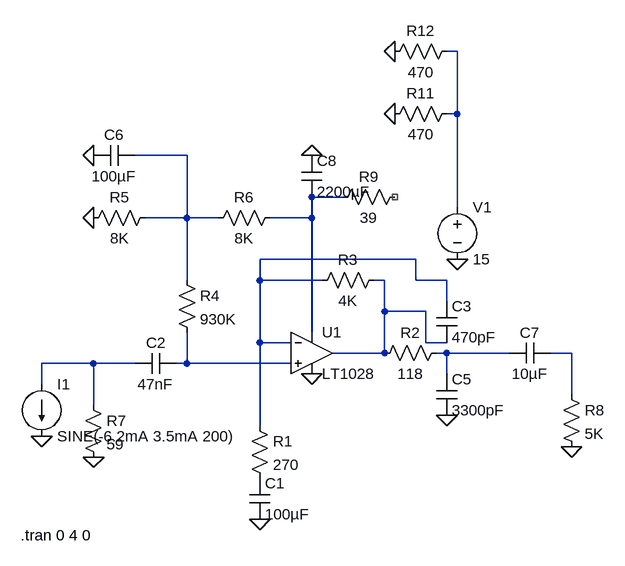
[diagram p0: schematic Draft14.asc]
Draft14.asc, the LTspice schematic file:
Version 4
SHEET 1 880 680
WIRE 400 -272 384 -272
WIRE 400 -176 400 -272
WIRE 400 -176 384 -176
WIRE -16 -112 -96 -112
WIRE 224 -48 176 -48
WIRE 400 -32 400 -176
WIRE -16 -16 -16 -112
WIRE -16 -16 -80 -16
WIRE 32 -16 -16 -16
WIRE 176 -16 176 -48
WIRE 176 -16 112 -16
WIRE 336 48 96 48
WIRE -16 80 -16 -16
WIRE 96 80 96 48
WIRE 192 80 96 80
WIRE 288 80 272 80
WIRE 336 80 336 48
WIRE 384 80 336 80
WIRE 384 112 384 80
WIRE 288 128 288 80
WIRE 352 128 288 128
WIRE 176 160 176 -16
WIRE 96 176 96 80
WIRE 144 176 96 176
WIRE 352 176 352 128
WIRE 384 176 352 176
WIRE 288 192 288 128
WIRE 288 192 208 192
WIRE 384 192 368 192
WIRE 480 192 384 192
WIRE 576 192 544 192
WIRE -160 208 -240 208
WIRE -96 208 -160 208
WIRE -16 208 -16 160
WIRE -16 208 -32 208
WIRE 144 208 -16 208
WIRE 384 224 384 192
WIRE -240 240 -240 208
WIRE 576 256 576 192
WIRE -160 272 -160 208
WIRE 96 304 96 176
FLAG 176 224 0
FLAG 96 448 0
FLAG 400 48 0
FLAG 384 288 0
FLAG -160 -112 0
FLAG -160 -16 0
FLAG -160 352 0
FLAG -240 320 0
FLAG 576 336 0
FLAG 176 -112 0
FLAG 304 -176 0
FLAG 304 -272 0
SYMBOL res 80 288 R0
SYMATTR InstName R1
SYMATTR Value 270
SYMBOL res 272 208 R270
WINDOW 0 32 56 VTop 2
WINDOW 3 0 56 VBottom 2
SYMATTR InstName R2
SYMATTR Value 118
SYMBOL res 176 96 R270
WINDOW 0 32 56 VTop 2
WINDOW 3 0 56 VBottom 2
SYMATTR InstName R3
SYMATTR Value 4K
SYMBOL cap 80 384 R0
SYMATTR InstName C1
SYMATTR Value 100µF
SYMBOL voltage 400 -48 R0
WINDOW 123 0 0 Left 2
WINDOW 39 0 0 Left 2
SYMATTR InstName V1
SYMATTR Value 15
SYMBOL res -32 64 R0
SYMATTR InstName R4
SYMATTR Value 930K
SYMBOL res -64 -32 R90
WINDOW 0 0 56 VBottom 2
WINDOW 3 32 56 VTop 2
SYMATTR InstName R5
SYMATTR Value 8K
SYMBOL res 128 -32 R90
WINDOW 0 0 56 VBottom 2
WINDOW 3 32 56 VTop 2
SYMATTR InstName R6
SYMATTR Value 8K
SYMBOL cap -32 192 R90
WINDOW 0 0 32 VBottom 2
WINDOW 3 32 32 VTop 2
SYMATTR InstName C2
SYMATTR Value 47nF
SYMBOL cap 368 112 R0
SYMATTR InstName C3
SYMATTR Value 470pF
SYMBOL cap 368 224 R0
SYMATTR InstName C5
SYMATTR Value 3300pF
SYMBOL cap -96 -128 R90
WINDOW 0 0 32 VBottom 2
WINDOW 3 32 32 VTop 2
SYMATTR InstName C6
SYMATTR Value 100µF
SYMBOL res -176 256 R0
SYMATTR InstName R7
SYMATTR Value 59
SYMBOL current -240 240 R0
WINDOW 123 0 0 Left 2
WINDOW 39 0 0 Left 2
SYMATTR InstName I1
SYMATTR Value SINE(-6.2mA 3.5mA 200)
SYMBOL cap 544 176 R90
WINDOW 0 0 32 VBottom 2
WINDOW 3 32 32 VTop 2
SYMATTR InstName C7
SYMATTR Value 10µF
SYMBOL res 560 240 R0
SYMATTR InstName R8
SYMATTR Value 5K
SYMBOL res 320 -64 R90
WINDOW 0 0 56 VBottom 2
WINDOW 3 32 56 VTop 2
SYMATTR InstName R9
SYMATTR Value 39
SYMBOL cap 160 -112 R0
SYMATTR InstName C8
SYMATTR Value 2200µF
SYMBOL LT1028 176 128 R0
SYMATTR InstName U1
SYMBOL res 400 -192 R90
WINDOW 0 0 56 VBottom 2
WINDOW 3 32 56 VTop 2
SYMATTR InstName R11
SYMATTR Value 470
SYMBOL res 400 -288 R90
WINDOW 0 0 56 VBottom 2
WINDOW 3 32 56 VTop 2
SYMATTR InstName R12
SYMATTR Value 470
TEXT -272 472 Left 2 !.tran 0 4 0

The netlist it stands for:
* Draft14.asc
R1 N004 P001 270
R2 N005 N006 118
R3 N004 N005 4K
C1 P001 0 100µF
V1 N001 0 15
R4 N002 N009 930K
R5 N002 0 8K
R6 N003 N002 8K
C2 N009 N008 47nF
C3 N004 N005 470pF
C5 N006 0 3300pF
C6 N002 0 100µF
R7 N008 0 59
I1 N008 0 SINE(-6.2mA 3.5mA 200)
C7 N007 N006 10µF
R8 N007 0 5K
R9 NC_01 N003 39
C8 0 N003 2200µF
XU1 N009 N004 N003 0 N005 LT1028  ; pins In+ In- V+ V- OUT
R11 N001 0 470
R12 N001 0 470
.tran 0 4 0
.lib LTC.lib
.backanno
.end